# Altium schematic sheet ADC.SchDoc
size A
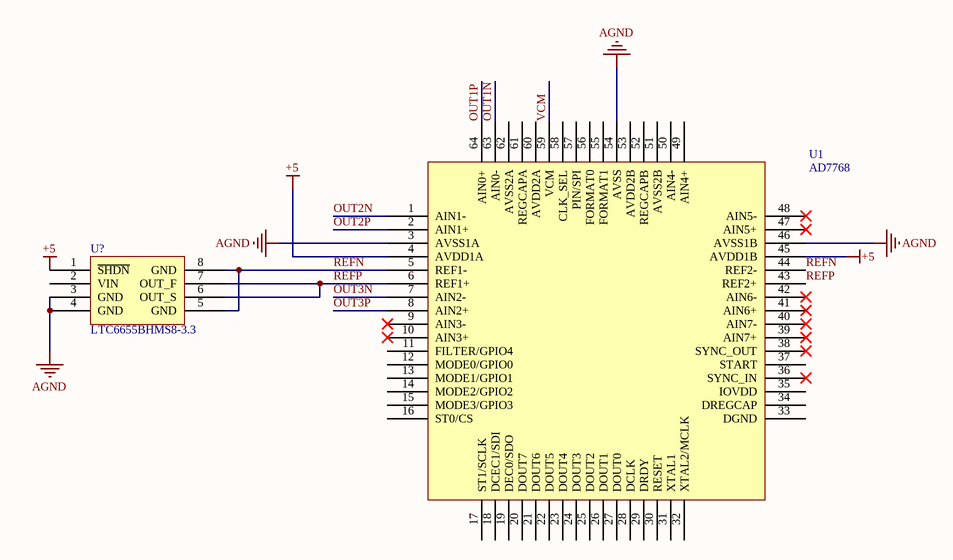
[diagram p0: ADC.SchDoc]

## Parts
U1  AD7768  [LQFP-64]
U?  LTC6655BHMS8-3.3  [MS-8]

## Nets
+5: U1.4(AVDD1A) U1.45(AVDD1B) U?.1(~{SHDN})
AGND: U1.3(AVSS1A) U1.46(AVSS1B) U1.54(AVSS) U?.3(GND) U?.4(GND)
OUT1N: U1.63(AIN0-)
OUT1P: U1.64(AIN0+)
OUT2N: U1.1(AIN1-)
OUT2P: U1.2(AIN1+)
OUT3N: U1.7(AIN2-)
OUT3P: U1.8(AIN2+)
REFN: U1.5(REF1-) U1.44(REF2-) U?.5(GND) U?.8(GND)
REFP: U1.6(REF1+) U1.43(REF2+) U?.6(OUT_S) U?.7(OUT_F)
VCM: U1.59(VCM)

Not connected (* = marked no-connect by the designer): U1 9(AIN3-)* 10(AIN3+)* 11(FILTER/GPIO4) 12(MODE0/GPIO0) 13(MODE1/GPIO1) 14(MODE2/GPIO2) 15(MODE3/GPIO3) 16(ST0/CS) 17(ST1/SCLK) 18(DCEC1/SDI) 19(DEC0/SDO) 20(DOUT7) 21(DOUT6) 22(DOUT5) 23(DOUT4) 24(DOUT3) 25(DOUT2) 26(DOUT1) 27(DOUT0) 28(DCLK) 29(DRDY) 30(RESET) 31(XTAL1) 32(XTAL2/MCLK) 33(DGND) 34(DREGCAP) 35(IOVDD) 36(SYNC_IN)* 37(START) 38(SYNC_OUT)* 39(AIN7+)* 40(AIN7-)* 41(AIN6+)* 42(AIN6-)* 47(AIN5+)* 48(AIN5-)* 49(AIN4+) 50(AIN4-) 51(AVSS2B) 52(REGCAPB) 53(AVDD2B) 55(FORMAT1) 56(FORMAT0) 57(PIN/SPI) 58(CLK_SEL) 60(AVDD2A) 61(REGCAPA) 62(AVSS2A); U? 2(VIN)